# EasyEDA schematic Schematic.json
TITLE: Sheet_1; REV: 1.0; Date: 2021-06-30; Sheet: 1/1; Drawn By: Никита Волотович; Company: Your Company
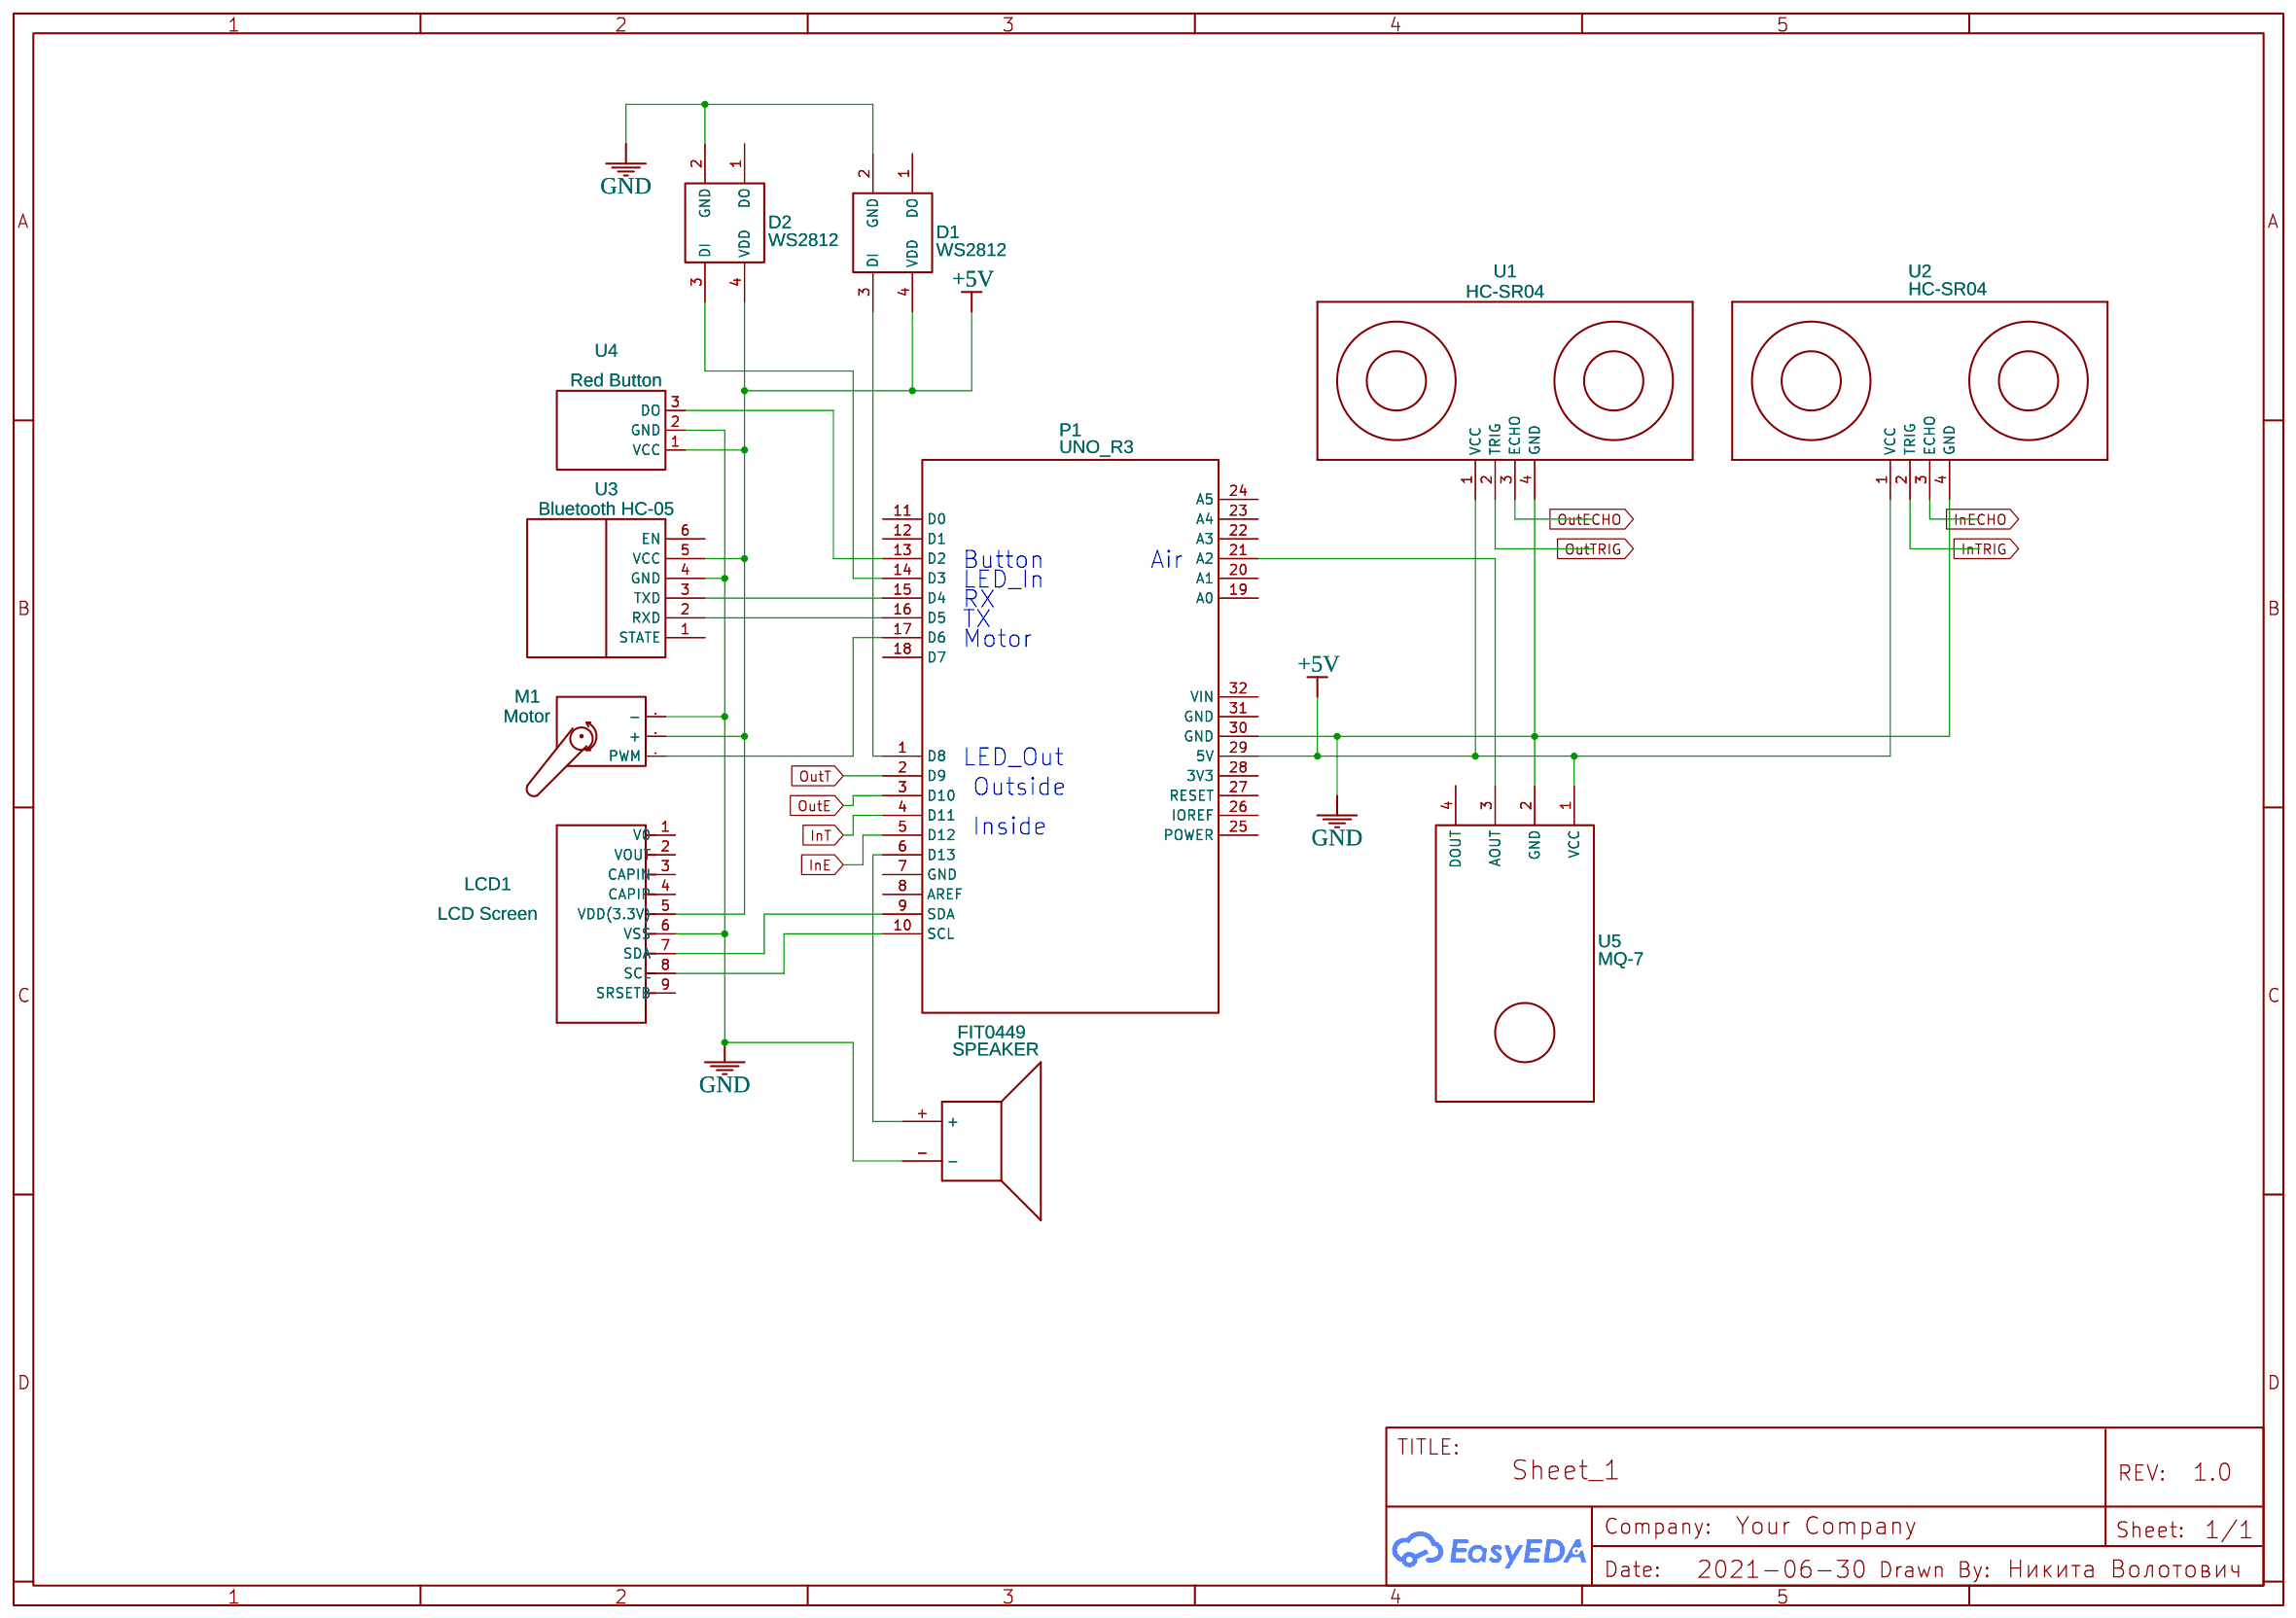
[diagram p0: schematic sheet]

## Parts
D1  WS2812  [WS2812B-2020]
D2  WS2812  [WS2812B-2020]
FIT0449  SPEAKER  [PCB_MOUNT_SPEAKER]
LCD1  LCD Screen  [LCD9-1.5-30X19.5MM]
M1  Motor
P1  UNO_R3  [UNO_R3]
U1  HC-SR04  [HC-SR04]
U2  HC-SR04  [HC-SR04]
U3  Bluetooth HC-05
U4  Red Button
U5  MQ-7  [MQ-7 FOOTPRINT]

## Library data of the parts
D1 D2 = WS2812: Contributor: caprinus
FIT0449 = SPEAKER: Contributor: ronel
LCD1 = 12 LCD Breadout: Tiny I2C Char LCD - 5V
M1 = Servo: Contributor: Emma Romeo; license: https://www.gnu.org/licenses/lgpl-2.1.html
P1 = UNO_R3: sourceId: 1T5FDZYC8
U1 U2 = HC-SR04: Ultrasonic Ranging Module HC-SR04; Contributor: h6000p
U3 = HC-05: Contributor: pavloklas
U4 = Button: Contributor: Mr pon4ik
U5 = MQ-7: Supplier: Robotshop; link: https://www.robotshop.com/ca/en/mq-7-gas-sensor.html; Contributor: Samuel.Reddekop

## Nets
+5V: D1.4(VDD) D2.4(VDD) LCD1.5(VDD(3.3V)) M1.2(+) P1.29(5V) U1.1(VCC) U2.1(VCC) U3.5(VCC) U4.1(VCC) U5.1(VCC)
GND: D1.2(GND) D2.2(GND) FIT0449.- LCD1.6(VSS) M1.3(-) P1.30(GND) U1.4(GND) U2.4(GND) U3.4(GND) U4.2(GND) U5.2(GND)
InE: P1.5(D12)
InT: P1.4(D11)
OutE: P1.3(D10)
OutT: P1.2(D9)
Net-(D1-3): D1.3(DI) P1.1(D8)
Net-(D2-3): D2.3(DI) P1.14(D3)
Net-(FIT0449-+): FIT0449.+ P1.6(D13)
Net-(LCD1-7): LCD1.7(SDA) P1.9(SDA)
Net-(LCD1-8): LCD1.8(SCL) P1.10(SCL)
Net-(M1-1): M1.1(PWM) P1.17(D6)
Net-(P1-13): P1.13(D2) U4.3(DO)
Net-(P1-15): P1.15(D4) U3.3(TXD)
Net-(P1-16): P1.16(D5) U3.2(RXD)
Net-(P1-21): P1.21(A2) U5.3(AOUT)

Not connected (* = marked no-connect by the designer): D1 1(DO); D2 1(DO); LCD1 1(V0) 2(VOUT) 3(CAPIN) 4(CAPIP) 9(SRSETB); P1 7(GND) 8(AREF) 11(D0) 12(D1) 18(D7) 19(A0) 20(A1) 22(A3) 23(A4) 24(A5) 25(POWER) 26(IOREF) 27(RESET) 28(3V3) 31(GND) 32(VIN); U1 2(TRIG) 3(ECHO); U2 2(TRIG) 3(ECHO); U3 1(STATE) 6(EN); U5 4(DOUT)

## Notes on the sheet
- Button
- Air
- LED_In
- RX
- Motor
- TX
- LED_Out
- Outside
- Inside
